# Altium project RTH1.0_GMU.PrjPcb
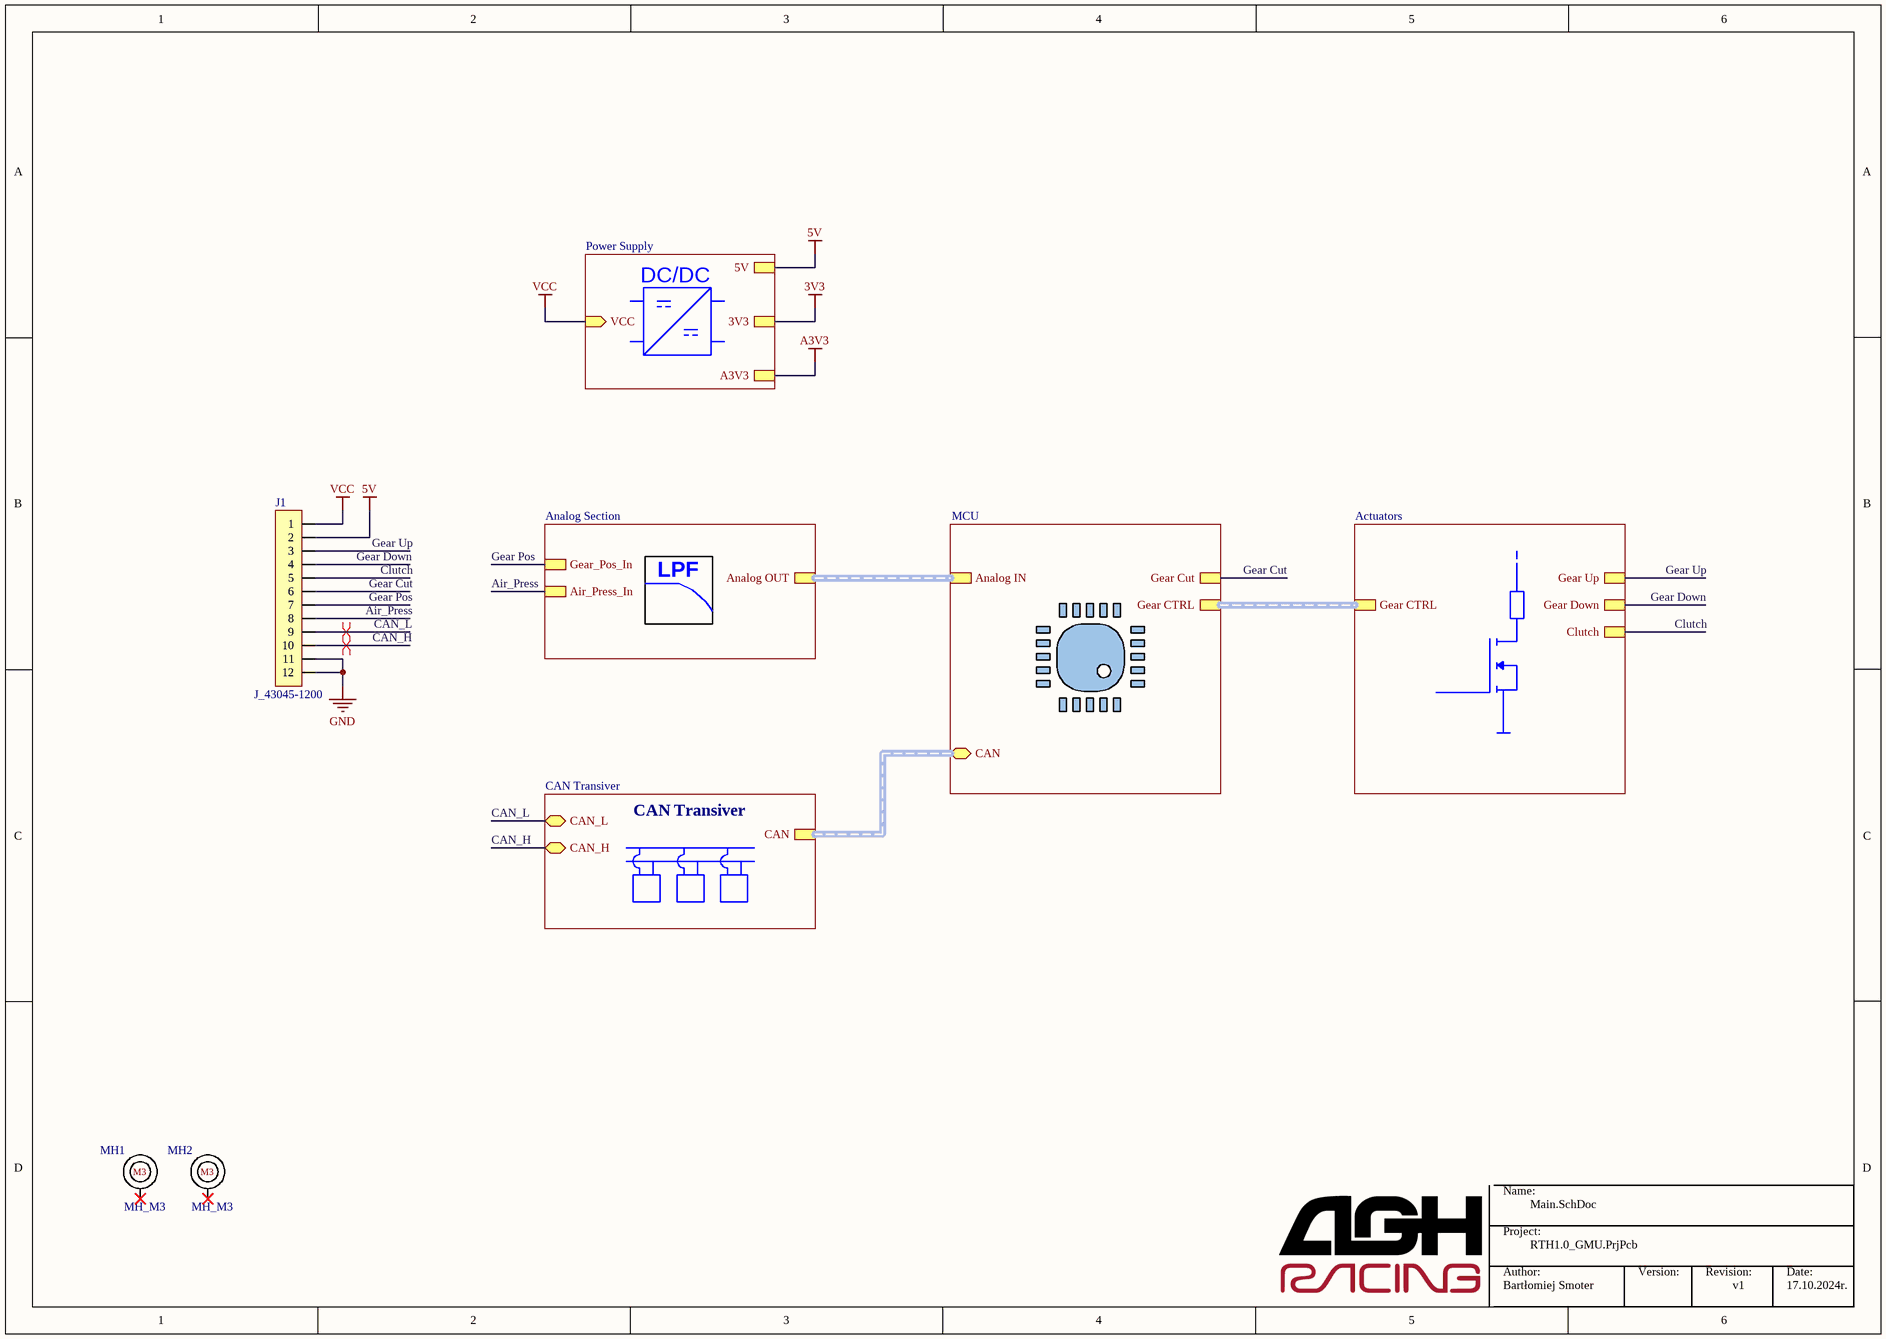
[diagram p0: Main.SchDoc]
6 sheets, 106 parts. Net scope: hierarchical (ports join the sheet entries above them; power ports are global).
Board file: GMU.PcbDoc
Sheets:
  Main.SchDoc
    Power Supply = PowerSupply.SchDoc
    MCU = MCU.SchDoc
    CAN Transiver = CANTransiver.SchDoc
    Analog Section = Analog_Section.SchDoc
    Actuators = Actuators.SchDoc

## Sheet Main.SchDoc: GMU HY
size 353 x 250 mm; Date: 17.10.2024r.; Author: Bartłomiej Smoter; CompanyName: AGH Racing; Revision: v1; SheetNumber: 1; SheetTotal: 6

### Parts
J1  J_43045-1200  [43045-1200]
MH1  MH_M3  [M3]  (no BOM)
MH2  MH_M3  [M3]  (no BOM)

### Sub-sheets
Actuators = Actuators: Gear Up, Gear Down, Clutch, Gear CTRL
Analog Section = Analog_Section: Gear_Pos_In, Air_Press_In, Analog OUT
CAN Transiver = CANTransiver: CAN_H (bidir), CAN_L (bidir), CAN
MCU = MCU: CAN (bidir), Gear CTRL, Gear Cut, Analog IN
Power Supply = PowerSupply: VCC (in), 3V3, 5V, A3V3

### Nets
5V: J1.4(2) ; sheet Power Supply/5V
GND: J1.1(12) J1.11
VCC: J1.7(1) ; sheet Power Supply/VCC  [project net 12V_IN]
Air_Press: J1.12(8) ; sheet Analog Section/Air_Press_In
CAN_H: J1.2(10) ; sheet CAN Transiver/CAN_H
CAN_L: J1.8(9) ; sheet CAN Transiver/CAN_L
Clutch: J1.10(5) ; sheet Actuators/Clutch
Gear Cut: J1.5(6) ; sheet MCU/Gear Cut
Gear Down: J1.3(4) ; sheet Actuators/Gear Down
Gear Pos: J1.6(7) ; sheet Analog Section/Gear_Pos_In
Gear Up: J1.9(3) ; sheet Actuators/Gear Up

Not connected (* = marked no-connect by the designer): MH1 1*; MH2 1*

### Buses and harness runs
harness sheet Actuators/Gear CTRL = sheet MCU/Gear CTRL
harness sheet Analog Section/Analog OUT = sheet MCU/Analog IN
harness sheet CAN Transiver/CAN = sheet MCU/CAN

### Layout directives
differential pair: CAN_H, CAN_L

### Notes on the sheet
- DC/DC
- LPF
- CAN
- Transiver
- Name:
- Project:
- Author:
- Version:
- Revision:
- Date:

### Library data of the parts
J1 = CMP-002-00073-5: Male; Micro-Fit 3.0; 12 Pos. 3mm; 8.5A 600V; Right Angle THT; Mating Part Num.: 43025-1200; Revision Num.: 1; Mating Terminal Num.: 43030-0001; Pin Amount: 12; Mounting Style: Right-Angle; Man. Part Num.: 43045-1200; Series: Micro-Fit 3.0; Max Current Rating: 8.5A; Gender: Male; Pitch: 3mm; HelpURL: https://www.molex.com/en-us/products/part-detail/0430451200?display=pdf; Voltage Rating: 600V; Mounting Technology: THT
MH1 MH2 = CMP-00028-00002-1: Mounting hole; M3 Screw; 3.4mm x 4.3mm; Revision Num.: 1; Man. Part Num.: M3; Diameter: 4.3mm; Hole size: 3.4mm

## Sheet PowerSupply.SchDoc
size 353 x 250 mm; Date: 17.10.2024r.; Author: Bartlomiej Smoter; CompanyName: AGH Racing; Revision: v1; SheetNumber: 2; SheetTotal: 6
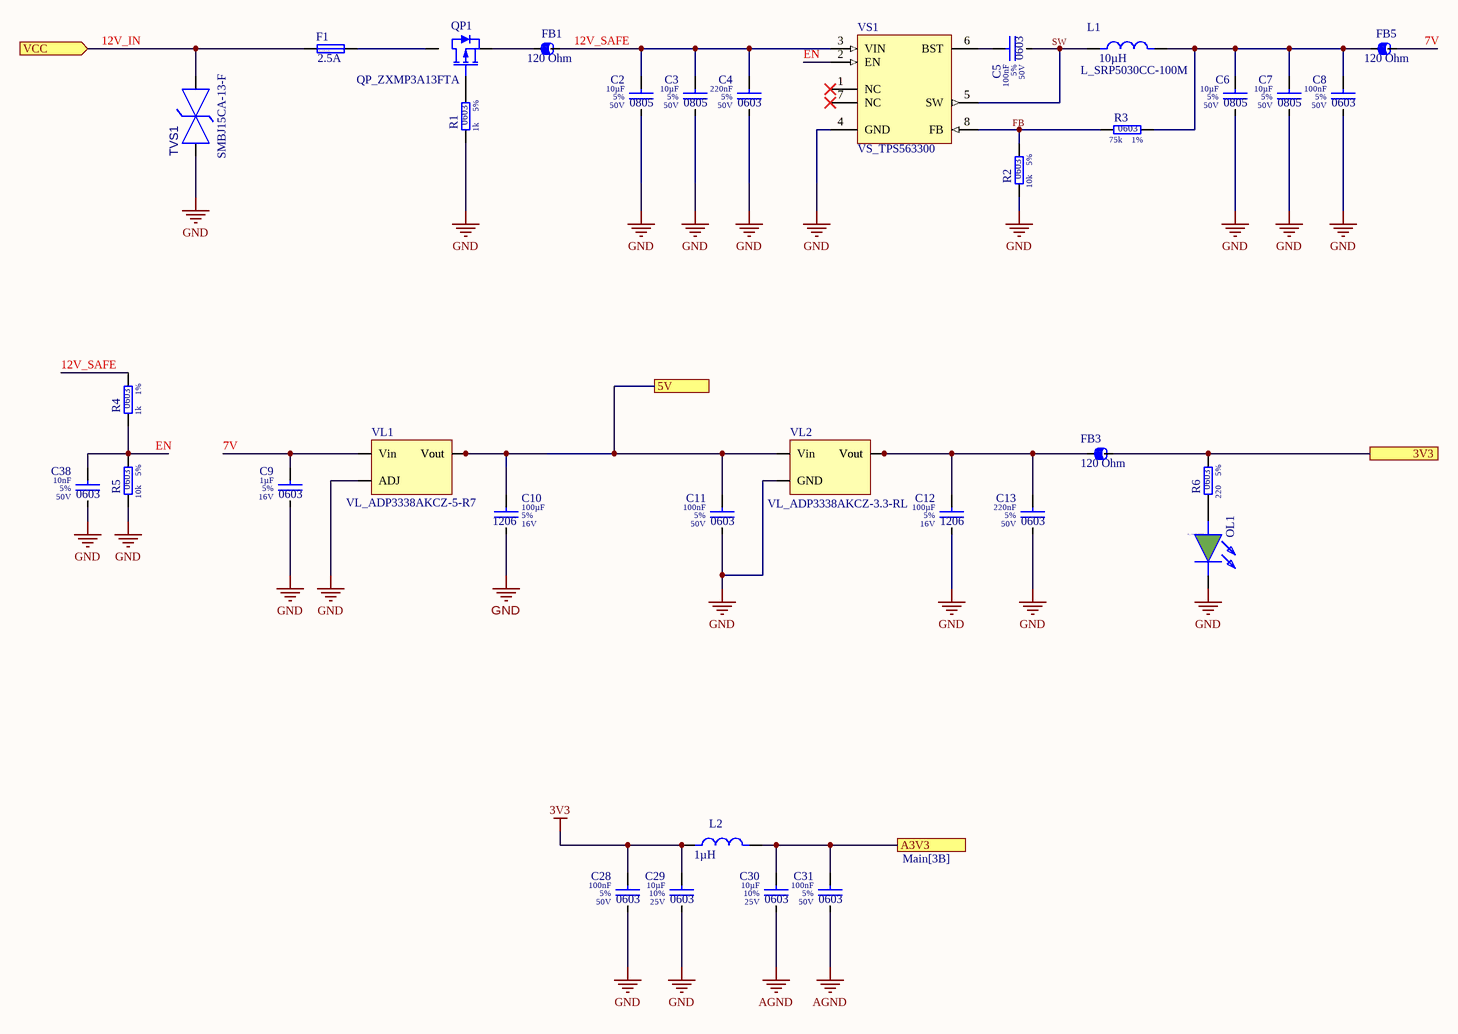
[diagram p1: PowerSupply.SchDoc]

### Parts
C2  value 10µF  Tolerance: 5%  Voltage Rating: 50V  Case/Package: 0805  [0805_Capacitor]  (hidden comment: C_10u_50V_0805_10)
C3  value 10µF  Tolerance: 5%  Voltage Rating: 50V  Case/Package: 0805  [0805_Capacitor]  (hidden comment: C_10u_50V_0805_10)
C4  value 220nF  Tolerance: 5%  Voltage Rating: 50V  Case/Package: 0603  [0603_HandSold_Capacitor]  (hidden comment: C_220n_50V_0603_5)
C5  value 100nF  Tolerance: 5%  Voltage Rating: 50V  Case/Package: 0603  [0603_HandSold_Capacitor]  (hidden comment: C_100n_50V_0603_5)
C6  value 10µF  Tolerance: 5%  Voltage Rating: 50V  Case/Package: 0805  [0805_Capacitor]  (hidden comment: C_10u_50V_0805_10)
C7  value 10µF  Tolerance: 5%  Voltage Rating: 50V  Case/Package: 0805  [0805_Capacitor]  (hidden comment: C_10u_50V_0805_10)
C8  value 100nF  Tolerance: 5%  Voltage Rating: 50V  Case/Package: 0603  [0603_HandSold_Capacitor]  (hidden comment: C_100n_50V_0603_5)
C9  value 1µF  Tolerance: 5%  Voltage Rating: 16V  Case/Package: 0603  [0603_HandSold_Capacitor]  (hidden comment: C_1u_16V_0603_5)
C10  value 100µF  Tolerance: 5%  Voltage Rating: 16V  Case/Package: 1206  [1206_HandSold_Capacitor]  (hidden comment: C_100u_16V_1206_5)
C11  value 100nF  Tolerance: 5%  Voltage Rating: 50V  Case/Package: 0603  [0603_HandSold_Capacitor]  (hidden comment: C_100n_50V_0603_5)
C12  value 100µF  Tolerance: 5%  Voltage Rating: 16V  Case/Package: 1206  [1206_HandSold_Capacitor]  (hidden comment: C_100u_16V_1206_5)
C13  value 220nF  Tolerance: 5%  Voltage Rating: 50V  Case/Package: 0603  [0603_HandSold_Capacitor]  (hidden comment: C_220n_50V_0603_5)
C28  value 100nF  Tolerance: 5%  Voltage Rating: 50V  Case/Package: 0603  [0603_HandSold_Capacitor]  (hidden comment: C_100n_50V_0603_5)
C29  value 10µF  Tolerance: 10%  Voltage Rating: 25V  Case/Package: 0603  [0603_HandSold_Capacitor]  (hidden comment: C_10u_25V_0603_10)
C30  value 10µF  Tolerance: 10%  Voltage Rating: 25V  Case/Package: 0603  [0603_HandSold_Capacitor]  (hidden comment: C_10u_25V_0603_10)
C31  value 100nF  Tolerance: 5%  Voltage Rating: 50V  Case/Package: 0603  [0603_HandSold_Capacitor]  (hidden comment: C_100n_50V_0603_5)
C38  value 10nF  Tolerance: 5%  Voltage Rating: 50V  Case/Package: 0603  [0603_HandSold_Capacitor]  (hidden comment: C_10n_50V_0603_5)
F1  F_1210_2.5A  Trip Current: 2.5A  [1210]
FB1  Impedance: 120 Ohm  [0805_FB]  (hidden comment: FB_BLM21PG121SN1D)
FB3  Impedance: 120 Ohm  [0805_FB]  (hidden comment: FB_BLM21PG121SN1D)
FB5  Impedance: 120 Ohm  [0805_FB]  (hidden comment: FB_BLM21PG121SN1D)
L1  L_SRP5030CC-100M  value 10µH  [L_2220]
L2  value 1µH  [0805_HandSold_Inductor]  (hidden comment: L_TMS201610ALM-1R0MTAA)
OL1  OL_150060VS75000  [0603_HandSold_LED]
QP1  QP_ZXMP3A13FTA  [SOT23]
R1  Tolerance: 5%  Resistance: 1k  Case/Package: 0603  [0603_HandSold_Resistor]  (hidden comment: R_1k_0603_5)
R2  Tolerance: 5%  Resistance: 10k  Case/Package: 0603  [0603_HandSold_Resistor]  (hidden comment: R_10k_0603_5)
R3  Tolerance: 1%  Resistance: 75k  Case/Package: 0603  [0603_HandSold_Resistor]  (hidden comment: R_75k_0603_1)
R4  Tolerance: 1%  Resistance: 1k  Case/Package: 0603  [0603_HandSold_Resistor]  (hidden comment: R_27k_0603_1)
R5  Tolerance: 5%  Resistance: 10k  Case/Package: 0603  [0603_HandSold_Resistor]  (hidden comment: R_10k_0603_5)
R6  Tolerance: 5%  Resistance: 220  Case/Package: 0603  [0603_HandSold_Resistor]  (hidden comment: R_220_0603_5)
TVS1  Man. Part Num.: SMBJ15CA-13-F  [DO-214AA (SMB J-Bend) footprint]  (hidden comment: TVS_SMBJ15CA-13-F)
VL1  VL_ADP3338AKCZ-5-R7  [SOT223-3]
VL2  VL_ADP3338AKCZ-3.3-RL  [SOT223-3]
VS1  VS_TPS563300  [SOT-5X3-8]

### Ports
3V3 (see Main[3A]), 5V (see Main[3A]), A3V3 (see Main[3B]), VCC (in, see Main[2A])

### Nets
3V3: C28.1 C29.1 FB3.2 L2.1 R6.2 ; port 3V3  [project net VDD]
5V: C10.1 C11.1 VL1.2(Vout) VL1.4(Vout) VL2.3(Vin) ; port 5V
12V_IN: F1.1 TVS1.2 ; port VCC
A3V3: C30.1 C31.1 L2.2 ; port A3V3
AGND: C30.2 C31.2
GND: C2.2 C3.2 C4.2 C6.2 C7.2 C8.2 C9.2 C10.2 C11.2 C12.2 C13.2 C28.2 C29.2 C38.2 OL1.1(K) R1.1 R2.1 R5.1 TVS1.1 VL1.1(ADJ) VL2.1(GND) VS1.4(GND)
7V: C9.1 FB5.2 VL1.3(Vin)
12V_SAFE: C2.1 C3.1 C4.1 FB1.2 R4.2 VS1.3(VIN)
EN: C38.1 R4.1 R5.2 VS1.2(EN)
FB: R2.2 R3.1 VS1.8(FB)
SW: C5.2 L1.1 VS1.5(SW)
NetC5_1: C5.1 VS1.6(BST)
NetC6_1: C6.1 C7.1 C8.1 FB5.1 L1.2 R3.2
NetC12_1: C12.1 C13.1 FB3.1 VL2.2(Vout) VL2.4(Vout)
NetF1_2: F1.2 QP1.3(D)
NetFB1_1: FB1.1 QP1.2(S)
NetOL1_2: OL1.2(A) R6.1
NetQP1_1: QP1.1(G) R1.2

Not connected (* = marked no-connect by the designer): VS1 1(NC)* 7(NC)*

### Notes on the sheet
- Name:
- Author:
- Project:
- Revision:
- Date:

### Library data of the parts
C2 C3 C6 C7 = CMP-001-00003-15: Capacitor Type: Ceramic; Revision Num.: 1; HelpURL: https://www.tme.eu/Document/58bb7db4269ac3ad53d1aa3c0ade9bab/GRM.pdf; Mounting Technology: SMT
C4 C13 = CMP-001-00023-24: Revision Num.: 1; Capacitor Type: Ceramic; HelpURL: https://www.mouser.pl/datasheet/2/40/KGM_X7R-3223212.pdf; Mounting Technology: SMT
C5 C8 C11 = CMP-001-00008-25: Capacitor Type: Ceramic; Revision Num.: 1; Mounting Technology: SMT; HelpURL: https://www.tme.eu/Document/78f46414e6dac38b7cca12338ea208b0/X7RDielectric.pdf
C9 = CMP-001-00014-23: Revision Num.: 1; Capacitor Type: Ceramic; HelpURL: https://eu.mouser.com/datasheet/2/40/KGM_X7R-3223212.pdf; Mounting Technology: SMT
C10 C12 = CMP-001-00056-1: Revision Num.: 0; Capacitor Type: Ceramic; Mounting Technology: SMT; HelpURL: https://www.tme.eu/Document/7e71bc7e80441897b2dc5cf4de77e476/c-series_en.pdf
C28 C31 = CMP-001-00008-26: Capacitor Type: Ceramic; Revision Num.: 1; HelpURL: https://www.tme.eu/Document/78f46414e6dac38b7cca12338ea208b0/X7RDielectric.pdf; Mounting Technology: SMT
C29 C30 = CMP-001-00061-2: C_10u_10V_0603_10; Capacitor Type: Ceramic; Revision Num.: 1; Mounting Technology: SMT; HelpURL: https://www.tme.eu/Document/58bb7db4269ac3ad53d1aa3c0ade9bab/GRM.pdf
C38 = CMP-001-00009-25: Capacitor Type: Ceramic; Revision Num.: 1; Mounting Technology: SMT; HelpURL: https://www.tme.eu/Document/78f46414e6dac38b7cca12338ea208b0/X7RDielectric.pdf
F1 = CMP-005-00012-5: Fuse; Resettable; MF-USHT; 0.5A, 2.5A, 20A; 30V, smt; Man. Part Num.: MF-USHT050KX-2; Revision Num.: 1.1; Hold Current: 500mA; Current Rating: 20A; Mounting Technology: SMT; Series: MF-USHT; Case/Package: 1210; Maximum Voltage: 30V; HelpURL: https://www.mouser.pl/datasheet/2/54/mf_usht-1128467.pdf
FB1 = CMP-006-00000-8: Ferrite Beads 120 OHM 25% Alternate Sizing Guide Below; ESR: 30m; Current Rating: 3A; Revision Num.: Revision #1; Mounting Technology: SMT; Man. Part Num.: BLM21PG121SN1D; Case/Package: 0805; HelpURL: https://www.mouser.pl/datasheet/2/281/ENFA0005-1915781.pdf
FB3 FB5 = CMP-006-00000-9: Ferrite Beads 120 OHM 25% Alternate Sizing Guide Below; Revision Num.: Revision #1; ESR: 30m; Current Rating: 3A; Case/Package: 0805; HelpURL: https://www.mouser.pl/datasheet/2/281/ENFA0005-1915781.pdf; Mounting Technology: SMT; Man. Part Num.: BLM21PG121SN1D
L1 = CMP-031-00003-1: SMD Ind,5.7x5.2x2.8mm,10uH+/-20%,2.8A,shd; ESR: 0.102; HelpURL: https://www.mouser.pl/datasheet/2/54/Bourns_07202023_SRP5030CC-3247830.pdf; Current Rating: 2.8A; Man. Part Num.: SRP5030CC-100M; Mounting Technology: SMT; Case/Package: 2220
L2 = CMP-006-00019-2: Inductor; 1uH, 3.1A, 60mΩ, 20%, SMT; ESR: 60m; Revision Num.: 0; HelpURL: https://product.tdk.com/system/files/dam/doc/product/inductor/inductor/smd/catalog/inductor_commercial_power_tms201610alm_en.pdf; Case/Package: 0805; Mounting Technology: SMT; Current Rating: 3.1A; Tolerance: 20%; Man. Part Num.: TMS201610ALM-1R0MTAA
OL1 = CMP-007-00000-15: LED, 0603 Green 2V 30mA  72mW; Revision Num.: 1; Forward Voltage: 2V; Case/Package: 0603; Man. Part Num.: 150060VS75000; Mounting Technology: SMT; Colour: Green; Forward Current: 30mA; Power: 72mW; HelpURL: https://www.mouser.pl/datasheet/2/445/150060VS75000-3085276.pdf
QP1 = CMP-013-00002-22: MOSFET 30V P-Chnl UMOS; Vds / Vce: -30V; Transistor Type: PMOSFET; Vgs / Vbe: -1V; Id / Ic: -1.4A; Power: 625mW; Rds / Rce: 0.33; Revision Num.: Revision #1; Case/Package: SOT23; Mounting Technology: SMT; HelpURL: https://www.diodes.com/assets/Datasheets/ZXMP3A13F.pdf; Man. Part Num.: ZXMP3A13FTA
R1 = CMP-009-00001-19: Revision Num.: 1; Voltage Rating: 75V; Power: 100mW; HelpURL: https://eu.mouser.com/datasheet/2/447/YAGEO_PYu_RC_Group_51_RoHS_L_12-3313492.pdf; Mounting Technology: SMT
R2 R5 = CMP-009-00002-20: Power: 100mW; Voltage Rating: 50V; Revision Num.: 1; HelpURL: https://www.tme.eu/Document/d2a72e545e5c8eb7bf2a04fa97535928/rc0603yageo.pdf; Mounting Technology: SMT
R3 = CMP-009-00121-1: Voltage Rating: 75V; Power: 100mW; Mounting Technology: SMT; HelpURL: https://eu.mouser.com/datasheet/2/315/AOA0000C304-1149620.pdf
R4 = CMP-009-00162-1: Voltage Rating: 75V; Power: 100mW; Revision Num.: 1; Mounting Technology: SMT; HelpURL: https://www.tme.eu/Document/622e28308c06d160637f2b14751ba16b/Data%20Sheet%20CRCW_BCe3.pdf
R6 = CMP-009-00033-15: Power: 100mW; Revision Num.: 1; Voltage Rating: 50V; Mounting Technology: SMT; HelpURL: https://www.mouser.pl/datasheet/2/315/AOA0000C334-1314047.pdf
TVS1 = CMP-00063-1: Diode; TVS; Bidirectional; 15V, 16.7V, 24.4V SMT; HelpURL: https://www.mouser.pl/datasheet/2/115/DIOD_S_A0003133144_1-2542279.pdf; Working Voltage: 15V; Breakdown Voltage: 16.7V; Case/Package: DO-214AA; Polarity: Bidirectional; Clamping Voltage: 24.4V; Mounting Technology: SMT
VL1 = CMP-019-00038-1: LDO; ADP3338AKCZ-5-R7; 1A; 5V; High accuracy over line and load: ±0.8% @ 25°C,; Revision Num.: 1; Power: 5W; Min Supply Voltage: -300mV; Max Supply Voltage: 8.5V; Case/Package: SOT223-3; Max Output Voltage: 5V; Mounting Technology: SMT; Min Output Voltage: 5V; HelpURL: https://www.mouser.pl/datasheet/2/609/ADP3338-1503401.pdf; Man. Part Num.: ADP3338AKCZ-5-R7; Series: ADP3338; Output Current: 1A
VL2 = CMP-019-00039-1: LDO; ADP3338AKCZ-5-R7; 1A; 3.3V; High accuracy over line and load: ±0.8% @ 25°C,; Min Supply Voltage: -300mV; Revision Num.: 1; Power: 5W; Max Supply Voltage: 8.5V; Series: ADP3338; Output Current: 1A; Case/Package: SOT223-3; Man. Part Num.: ADP3338AKCZ-3.3-RL; HelpURL: https://www.mouser.pl/datasheet/2/609/ADP3338-1503401.pdf; Min Output Voltage: 3.3V; Max Output Voltage: 3.3V; Mounting Technology: SMT
VS1 = CMP-019-00023-2: DC/DC Buck; 3.8-V to 28-V, 3-A Synchronous Buck Converter in SOT583 Package; Man. Part Num.: TPS563300DRLR; Revision Num.: 0; Max Supply Voltage: 28V; Max Output Voltage: 22V; Output Current: 3A; Min Output Voltage: 800mV; Min Supply Voltage: 3.8V; HelpURL: https://www.ti.com/lit/ds/symlink/tps563300.pdf?ts=1715787860656&ref_url=https%253A%252F%252Fwww.mouser.co.uk%252F; Mounting Technology: SMT; Case/Package: SOT582

## Sheet MCU.SchDoc
size 353 x 250 mm; Date: 17.10.2024r.; Author: Bartłomiej Smoter; CompanyName: AGH Racing; Revision: v1; SheetNumber: 4; SheetTotal: 6
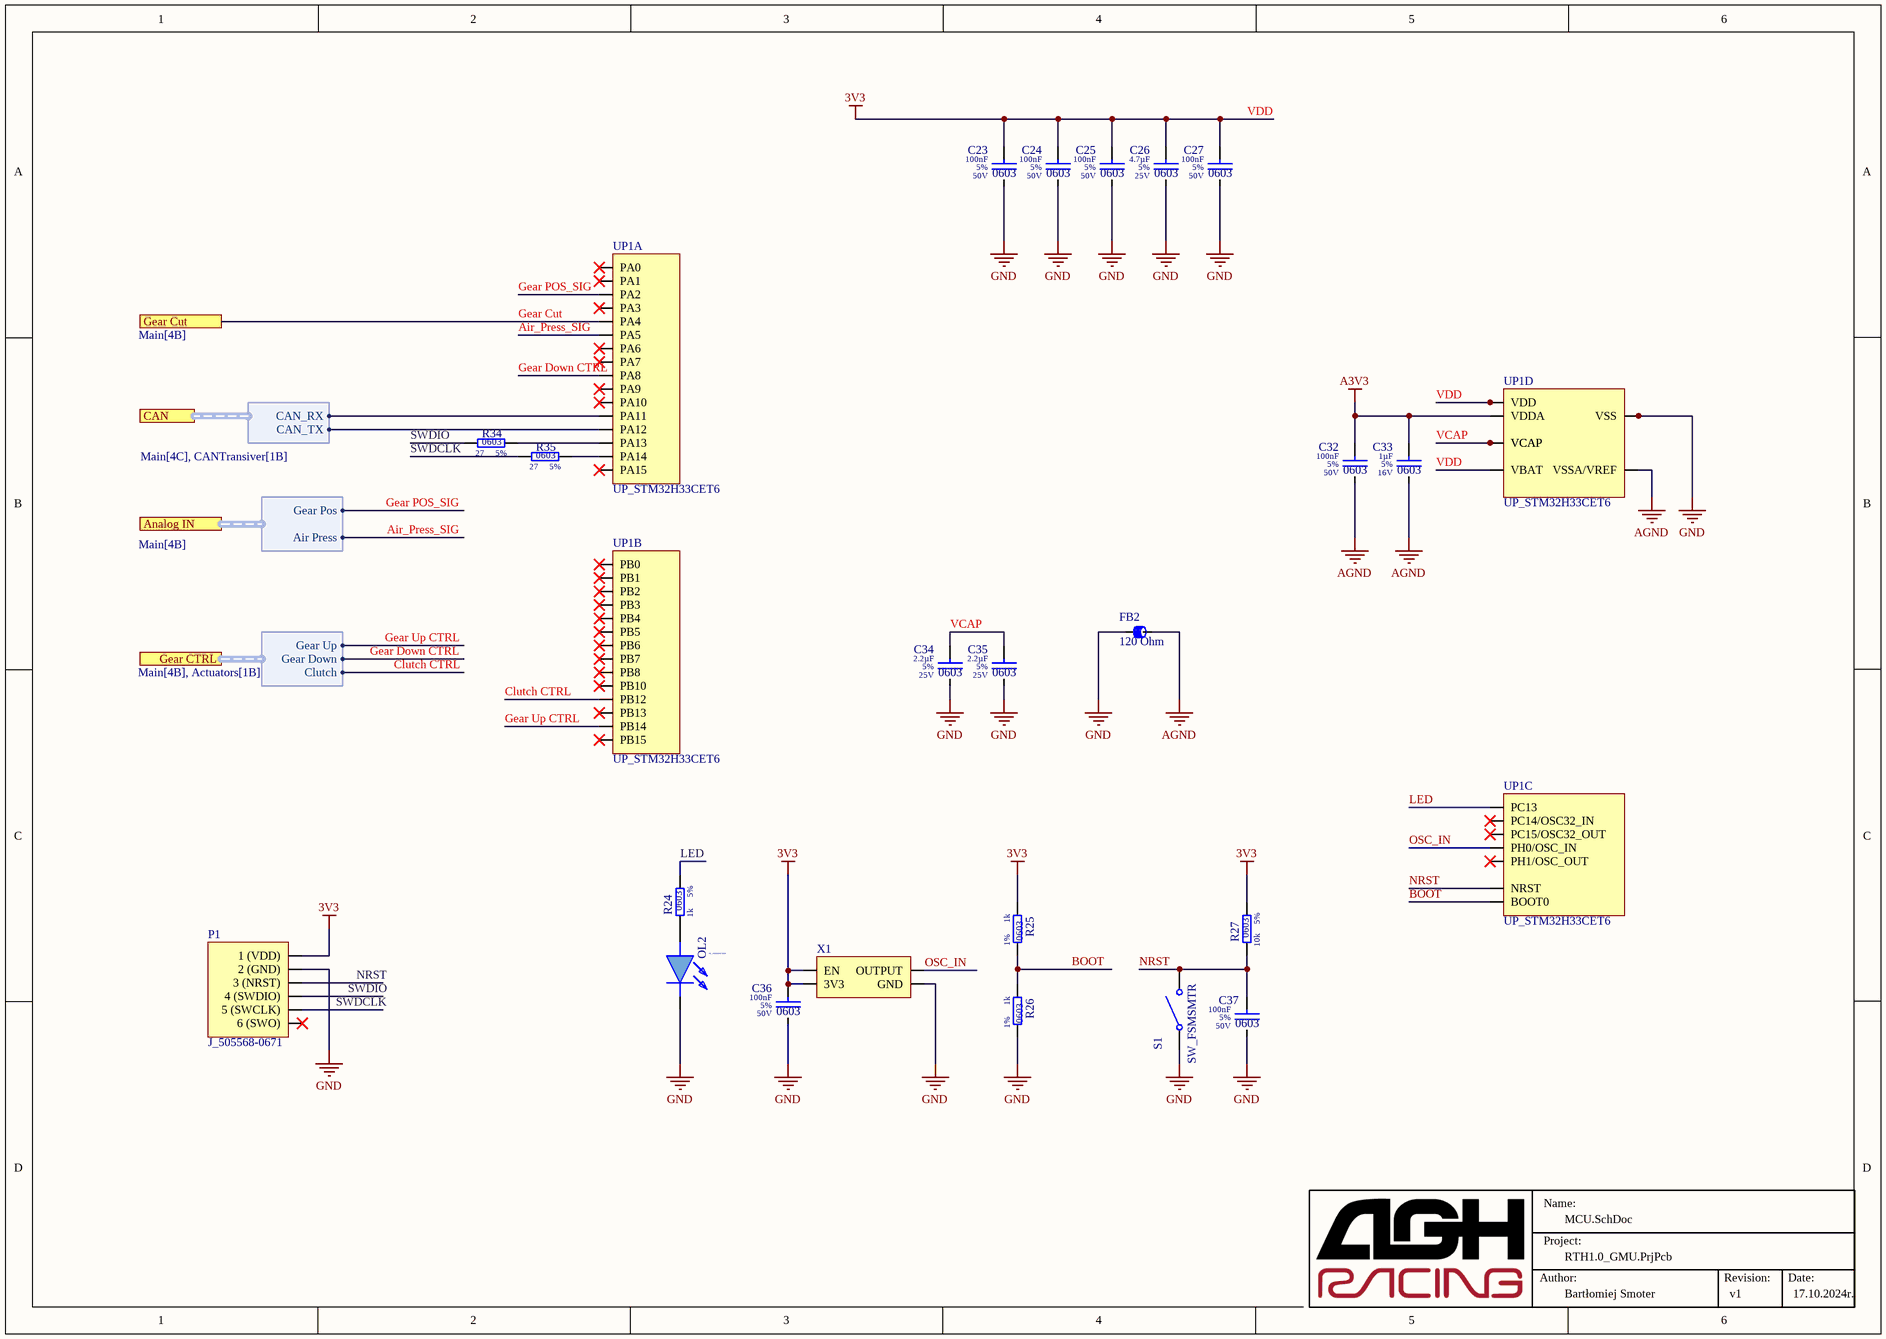
[diagram p2: MCU.SchDoc]

### Parts
C23  value 100nF  Tolerance: 5%  Voltage Rating: 50V  Case/Package: 0603  [0603_HandSold_Capacitor]  (hidden comment: C_100n_50V_0603_5)
C24  value 100nF  Tolerance: 5%  Voltage Rating: 50V  Case/Package: 0603  [0603_HandSold_Capacitor]  (hidden comment: C_100n_50V_0603_5)
C25  value 100nF  Tolerance: 5%  Voltage Rating: 50V  Case/Package: 0603  [0603_HandSold_Capacitor]  (hidden comment: C_100n_50V_0603_5)
C26  value 4.7µF  Tolerance: 5%  Voltage Rating: 25V  Case/Package: 0603  [0603_HandSold_Capacitor]  (hidden comment: C_4.7u_25V_0603_5)
C27  value 100nF  Tolerance: 5%  Voltage Rating: 50V  Case/Package: 0603  [0603_HandSold_Capacitor]  (hidden comment: C_100n_50V_0603_5)
C32  value 100nF  Tolerance: 5%  Voltage Rating: 50V  Case/Package: 0603  [0603_HandSold_Capacitor]  (hidden comment: C_100n_50V_0603_5)
C33  value 1µF  Tolerance: 5%  Voltage Rating: 16V  Case/Package: 0603  [0603_HandSold_Capacitor]  (hidden comment: C_1u_16V_0603_5)
C34  value 2.2µF  Tolerance: 5%  Voltage Rating: 25V  Case/Package: 0603  [0603_HandSold_Capacitor]  (hidden comment: C_2.2u_25V_0603_5)
C35  value 2.2µF  Tolerance: 5%  Voltage Rating: 25V  Case/Package: 0603  [0603_HandSold_Capacitor]  (hidden comment: C_2.2u_25V_0603_5)
C36  value 100nF  Tolerance: 5%  Voltage Rating: 50V  Case/Package: 0603  [0603_HandSold_Capacitor]  (hidden comment: C_100n_50V_0603_5)
C37  value 100nF  Tolerance: 5%  Voltage Rating: 50V  Case/Package: 0603  [0603_HandSold_Capacitor]  (hidden comment: C_100n_50V_0603_5)
FB2  Impedance: 120 Ohm  [0805_FB]  (hidden comment: FB_BLM21PG121SN1D)
OL2  OL_150060BS75000  [0603_HandSold_LED]
P1  J_505568-0671  [505568-0671]
R24  Tolerance: 5%  Resistance: 1k  Case/Package: 0603  [0603_HandSold_Resistor]  (hidden comment: R_1k_0603_5)
R25  Tolerance: 1%  Resistance: 1k  Case/Package: 0603  [0603_HandSold_Resistor]  (hidden comment: R_1k_0603_1)
R26  Tolerance: 1%  Resistance: 1k  Case/Package: 0603  [0603_HandSold_Resistor]  (hidden comment: R_1k_0603_1)
R27  Tolerance: 5%  Resistance: 10k  Case/Package: 0603  [0603_HandSold_Resistor]  (hidden comment: R_10k_0603_5)
R34  Tolerance: 5%  Resistance: 27  Case/Package: 0603  [0603_HandSold_Resistor]  (hidden comment: R_27_0603_5)
R35  Tolerance: 5%  Resistance: 27  Case/Package: 0603  [0603_HandSold_Resistor]  (hidden comment: R_27_0603_5)
S1  SW_FSMSMTR  [TECO-FSMSMTR_V]
UP1  UP_STM32H33CET6  [LQFP48]  (parts A,B,C,D of 4)
X1  X_16MHz_LFSPXO066657CUTT  [X_2mm_2.5mm_oscillator]  (value not drawn)

### Ports
Analog IN (harness ANAL, see Main[4B]), CAN (harness CAN, see Main[4C], CANTransiver[1B]), Gear CTRL (harness Gears, see Main[4B], Actuators[1B]), Gear Cut (see Main[4B])

### Harnesses
CAN: CAN_RX, CAN_TX
Gears: Gear Up, Gear Down, Clutch
ANAL: Gear Pos, Air Press

### Nets
A3V3: C32.1 C33.1 UP1.9(VDDA)
AGND: C32.2 C33.2 FB2.2 UP1.8(VSSA/VREF)
GND: C23.2 C24.2 C25.2 C26.2 C27.2 C34.2 C35.2 C36.2 C37.2 FB2.1 OL2.1(K) P1.2(2_(GND)) R26.2 S1.1 UP1.23(VSS) UP1.35(VSS) UP1.47(VSS) X1.2(GND)
VDD: C23.1 C24.1 C25.1 C26.1 C27.1 C36.1 P1.1(1_(VDD)) R25.1 R27.2 UP1.1(VBAT) UP1.24(VDD) UP1.36(VDD) UP1.48(VDD) X1.1(EN) X1.4(3V3)  [also labelled 3V3]
Air_Press_SIG: UP1.15(PA5) ; port Analog IN.Air Press  [project net Air_Press_RC_LPF]
BOOT: R25.2 R26.1 UP1.44(BOOT0)
CAN_RX: UP1.32(PA11) ; port CAN.CAN_RX
CAN_TX: UP1.33(PA12) ; port CAN.CAN_TX
Clutch CTRL: UP1.25(PB12) ; port Gear CTRL.Clutch
Gear Cut: UP1.14(PA4) ; port Gear Cut
Gear Down CTRL: UP1.29(PA8) ; port Gear CTRL.Gear Down
Gear POS_SIG: UP1.12(PA2) ; port Analog IN.Gear Pos
Gear Up CTRL: UP1.27(PB14) ; port Gear CTRL.Gear Up
LED: R24.2 UP1.2(PC13)
NRST: C37.1 P1.3(3_(NRST)) R27.1 S1.2 UP1.7(NRST)
OSC_IN: UP1.5(PH0/OSC_IN) X1.3(OUTPUT)
SWDCLK: P1.5(5_(SWCLK)) R35.1
SWDIO: P1.4(4_(SWDIO)) R34.1
VCAP: C34.1 C35.1 UP1.22(VCAP) UP1.46(VCAP)
NetOL2_2: OL2.2(A) R24.1
NetR34_2: R34.2 UP1.34(PA13)
NetR35_2: R35.2 UP1.37(PA14)

Not connected (* = marked no-connect by the designer): P1 6(6_(SWO))*; UP1 3(PC14/OSC32_IN)* 4(PC15/OSC32_OUT)* 6(PH1/OSC_OUT)* 10(PA0)* 11(PA1)* 13(PA3)* 16(PA6)* 17(PA7)* 18(PB0)* 19(PB1)* 20(PB2)* 21(PB10)* 26(PB13)* 28(PB15)* 30(PA9)* 31(PA10)* 38(PA15)* 39(PB3)* 40(PB4)* 41(PB5)* 42(PB6)* 43(PB7)* 45(PB8)*

### Notes on the sheet
- Name:
- Author:
- Project:
- Revision:
- Date:

### Library data of the parts
C23-C25 C27 C32 = CMP-001-00008-26: as C28 on sheet PowerSupply; HelpURL: https://www.tme.eu/Document/78f46414e6dac38b7cca12338ea208b0/X7RDielectric.pdf; Mounting Technology: SMT
C26 = CMP-001-00011-25: Revision Num.: 1; Capacitor Type: Ceramic; Mounting Technology: SMT; HelpURL: https://eu.mouser.com/datasheet/2/40/cx5r_KGM-3223198.pdf
C33 = CMP-001-00014-23: as C9 on sheet PowerSupply; HelpURL: https://eu.mouser.com/datasheet/2/40/KGM_X7R-3223212.pdf; Mounting Technology: SMT
C34 C35 = CMP-001-00022-23: Capacitor Type: Ceramic; Revision Num.: 1; HelpURL: https://eu.mouser.com/datasheet/2/281/1/GRT188C71E225KE13_01A-3158366.pdf; Mounting Technology: SMT
C36 C37 = CMP-001-00008-22: Revision Num.: 1; Capacitor Type: Ceramic; Mounting Technology: SMT; HelpURL: https://www.tme.eu/Document/78f46414e6dac38b7cca12338ea208b0/X7RDielectric.pdf
FB2 = CMP-006-00000-9: as FB3 on sheet PowerSupply; Case/Package: 0805; HelpURL: https://www.mouser.pl/datasheet/2/281/ENFA0005-1915781.pdf; Mounting Technology: SMT; Man. Part Num.: BLM21PG121SN1D
OL2 = CMP-007-00001-11: LED 0603, Blue, 3.2V, 30mA, 105mW; Revision Num.: 1; HelpURL: https://www.we-online.com/components/products/datasheet/150060BS75000.pdf; Power: 105mW; Forward Voltage: 3.2V; Colour: Blue; Case/Package: 0603; Forward Current: 30mA; Mounting Technology: SMT; Man. Part Num.: 150060BS75000
P1 = CMP-002-00003-12: Male; Micro-Lock Plus; 6 Pos. 1.25mm; 1.5A 50V; Straight; SMT;; Mating Part Num.: 45111-0600; Pin Amount: 6; Revision Num.: 1; Mounting Style: Straight; Max Current Rating: 1.5A; Mounting Technology: SMT; Voltage Rating: 50V; Man. Part Num.: 505568-0671; Gender: Male; HelpURL: https://www.molex.com/en-us/products/part-detail/5055680671?display=pdf; Pitch: 1.25mm; Series: Micro-Lock Plus
R24 = CMP-009-00001-19: as R1 on sheet PowerSupply; HelpURL: https://eu.mouser.com/datasheet/2/447/YAGEO_PYu_RC_Group_51_RoHS_L_12-3313492.pdf; Mounting Technology: SMT
R25 R26 = CMP-009-00099-4: Revision Num.: 1; Voltage Rating: 75V; Power: 100mW; HelpURL: https://www.tme.eu/Document/622e28308c06d160637f2b14751ba16b/Data%20Sheet%20CRCW_BCe3.pdf; Mounting Technology: SMT
R27 = CMP-009-00002-16: Voltage Rating: 50V; Revision Num.: 1; Power: 100mW; HelpURL: https://www.tme.eu/Document/d2a72e545e5c8eb7bf2a04fa97535928/rc0603yageo.pdf; Mounting Technology: SMT
R34 R35 = CMP-009-00038-16: Voltage Rating: 50V; Revision Num.: 1; Power: 100mW; HelpURL: https://www.mouser.pl/datasheet/2/54/cr-1858361.pdf; Mounting Technology: SMT
S1 = CMP-011-00002-8: Switch; Tact; OFF-(ON); 50mA; 24V; Revision Num.: 1; Switch Type: Tact; Man. Part Num.: FSMSMTR; Mounting Technology: SMT; HelpURL: https://www.mouser.pl/ProductDetail/TE-Connectivity-Alcoswitch/FSMSMTR?qs=UhRTNahLC3z8whMdncX%252BKw%3D%3D; Configuration: OFF-(ON); Current Rating: 50mA; Voltage Rating: 24V
UP1 = CMP-020-00018-2: MCU High-performance Arm Cortex-M33 MCU 512-Kbyte Flash 272-Kbyte RAM 250 MHz CPU; Clock Frequency: 250MHz; ROM Size: 512kB; Revision Num.: 1; Max Supply Voltage: 3.6V; Min Supply Voltage: 1.7V; RAM Size: 272kB; Series: STM32H533xx; HelpURL: https://www.google.com/url?sa=t&source=web&rct=j&opi=89978449&url=https://www.st.com/resource/en/datasheet/stm32h753vi.pdf&ved=2ahUKEwiFsajI8PeHAxUmDRAIHcL-A8EQFnoECBQQAQ&usg=AOvVaw1bta1P1SH6GWAhwR0-a_c9; Case/Package: LQFP48; Pins: 37; Mounting Technology: SMT; Man. Part Num.: STM32H33CET6
X1 = X_16MHz_LFSPXO066657CUTT-6: Frequency: 16MHz; HelpURL: https://www.tme.eu/Document/f2507c161887e0dea281275093e92f79/LFSPXO066657CUTT.pdf; Man. Part Num.: LFSPXO066657CUTT; Mounting Technology: SMT

## Sheet CANTransiver.SchDoc
size 250 x 176 mm; Date: 17.10.2024r.; Author: Bartłomiej Smoter; Revision: v1; SheetNumber: 3; SheetTotal: 6
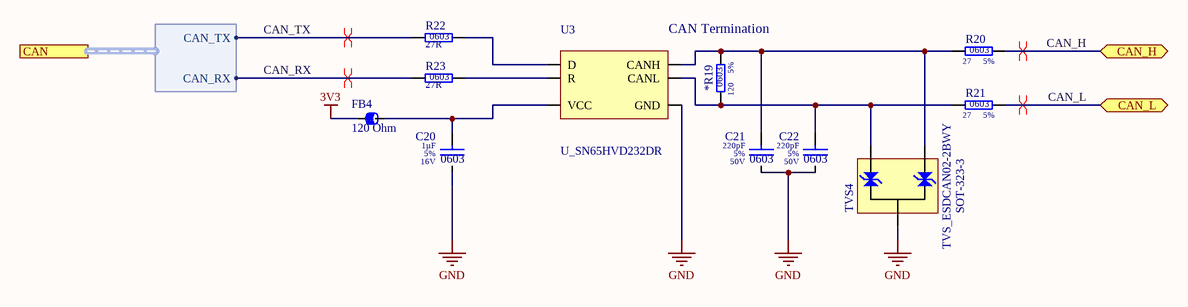
[diagram p3: CANTransiver.SchDoc]

### Parts
*R19  Tolerance: 5%  Resistance: 120  Case/Package: 0603  [0603_HandSold_Resistor]  (hidden comment: R_120_0603_5)
C20  value 1µF  Tolerance: 5%  Voltage Rating: 16V  Case/Package: 0603  [0603_HandSold_Capacitor]  (hidden comment: C_1u_16V_0603_5)
C21  value 220pF  Tolerance: 5%  Voltage Rating: 50V  Case/Package: 0603  [0603_HandSold_Capacitor]  (hidden comment: C_220p_50V_0603_5)
C22  value 220pF  Tolerance: 5%  Voltage Rating: 50V  Case/Package: 0603  [0603_HandSold_Capacitor]  (hidden comment: C_220p_50V_0603_5)
FB4  Impedance: 120 Ohm  [0805_FB]  (hidden comment: FB_BLM21PG121SN1D)
R20  Tolerance: 5%  Resistance: 27  Case/Package: 0603  [0603_HandSold_Resistor]  (hidden comment: R_27_0603_5)
R21  Tolerance: 5%  Resistance: 27  Case/Package: 0603  [0603_HandSold_Resistor]  (hidden comment: R_27_0603_5)
R22  value 27R  SCH_Footprint: 0603  [R_0603_1608]  (hidden comment: Resistor)
R23  value 27R  SCH_Footprint: 0603  [R_0603_1608]  (hidden comment: Resistor)
TVS4  TVS_ESDCAN02-2BWY  [SOT-323-3]
U3  U_SN65HVD232DR  [SOIC8]

### Ports
CAN (harness CAN, see Main[3C], MCU[1B]), CAN_H (bidir, see Main[2C]), CAN_L (bidir, see Main[2C])

### Harnesses
CAN: CAN_TX, CAN_RX

### Nets
3V3: FB4.1  [project net VDD]
GND: C20.2 C21.2 C22.2 TVS4.3 U3.2(GND)
CAN_H: R20.2 ; port CAN_H
CAN_L: R21.2 ; port CAN_L
CAN_RX: R23.1 ; port CAN.CAN_RX
CAN_TX: R22.1 ; port CAN.CAN_TX
Net*R19_1: *R19.1 C22.1 R21.1 TVS4.2 U3.6(CANL)
Net*R19_2: *R19.2 C21.1 R20.1 TVS4.1 U3.7(CANH)
NetC20_1: C20.1 FB4.2 U3.3(VCC)
NetR22_2: R22.2 U3.1(D)
NetR23_2: R23.2 U3.4(R)

### Layout directives
differential pair: CAN_H, CAN_L, CAN_RX, CAN_TX

### Notes on the sheet
- CAN Termination
- Name:
- Author:
- Project:
- Revision:
- Date:

### Library data of the parts
*R19 = CMP-009-00040-15: Power: 100mW; Voltage Rating: 50V; Revision Num.: 1; SCH_Footprint: 0603; Mounting Technology: SMT; HelpURL: https://www.tme.eu/Document/d2a72e545e5c8eb7bf2a04fa97535928/rc0603yageo.pdf
C20 = CMP-001-00014-23: as C9 on sheet PowerSupply; HelpURL: https://eu.mouser.com/datasheet/2/40/KGM_X7R-3223212.pdf; Mounting Technology: SMT
C21 C22 = CMP-001-00019-21: Revision Num.: 1; Capacitor Type: Ceramic; Mounting Technology: SMT; Revision: 1; HelpURL: https://www.tme.eu/Document/bbf9b851c2f67970461c4f5edb477604/C0GNP0-Dielectric.pdf
FB4 = CMP-006-00000-9: as FB3 on sheet PowerSupply; Case/Package: 0805; HelpURL: https://www.mouser.pl/datasheet/2/281/ENFA0005-1915781.pdf; Mounting Technology: SMT; Man. Part Num.: BLM21PG121SN1D
R20 R21 = CMP-009-00038-16: as R34 on sheet MCU; HelpURL: https://www.mouser.pl/datasheet/2/54/cr-1858361.pdf; Mounting Technology: SMT
R22 R23 = R_27R_0603_1: Manufacturer: Vishay; Manufacturer Part Number: CRCW060327R0FKEAHP; Voltage: 75V; Power: 330mW; Tolerance: 1%; Part Number: R_27R_0603_1; HelpURL: https://www.vishay.com/docs/20043/crcwhpe3.pdf; Supplier 1: TME; Supplier 2: RS Components; Supplier 3: Farnell; Supplier Part Number 3: 1738883; Supplier 4: Mouser; Supplier Part Number 4: 71-CRCW060327R0FKEAH; Supplier 5: Digi-Key; Supplier Part Number 5: 541-27.0SCT-ND; Supplier 6: LCSC; Supplier Part Number 6: C313718
TVS4 = CMP-013-00005-12: Diode; 2x TVS; 26.5V 28.5V 44V; Revision Num.: 1; Polarity: Bidirectional; Case/Package: SOT-323-3; Breakdown Voltage: 28.5V; Mounting Technology: SMT; Man. Part Num.: ESDCAN02-2BWY; HelpURL: https://www.mouser.pl/datasheet/2/389/esdcan03_2bwy-1849066.pdf; Working Voltage: 26.5V; Clamping Voltage: 44V
U3 = CMP-013-00004-10: Transceiver; CAN; SN65HVD232; 1Mb/s; 3.3V SMT; Min Supply Voltage: 3V; Max Supply Voltage: 3.6V; Revision Num.: 1; HelpURL: https://www.ti.com/general/docs/suppproductinfo.tsp?distId=26&gotoUrl=https://www.ti.com/lit/gpn/sn65hvd230; Mounting Technology: SMT; Data Rate: 1Mb/s; Man. Part Num.: SN65HVD232DR; Series: SN65HVD232; Case/Package: SOIC8; Communication: CAN

## Sheet Analog_Section.SchDoc
size 353 x 250 mm; Date: 17.10.2024r.; Author: Bartłomiej Smoter; CompanyName: AGH Racing; Revision: v1; SheetNumber: 5; SheetTotal: 6
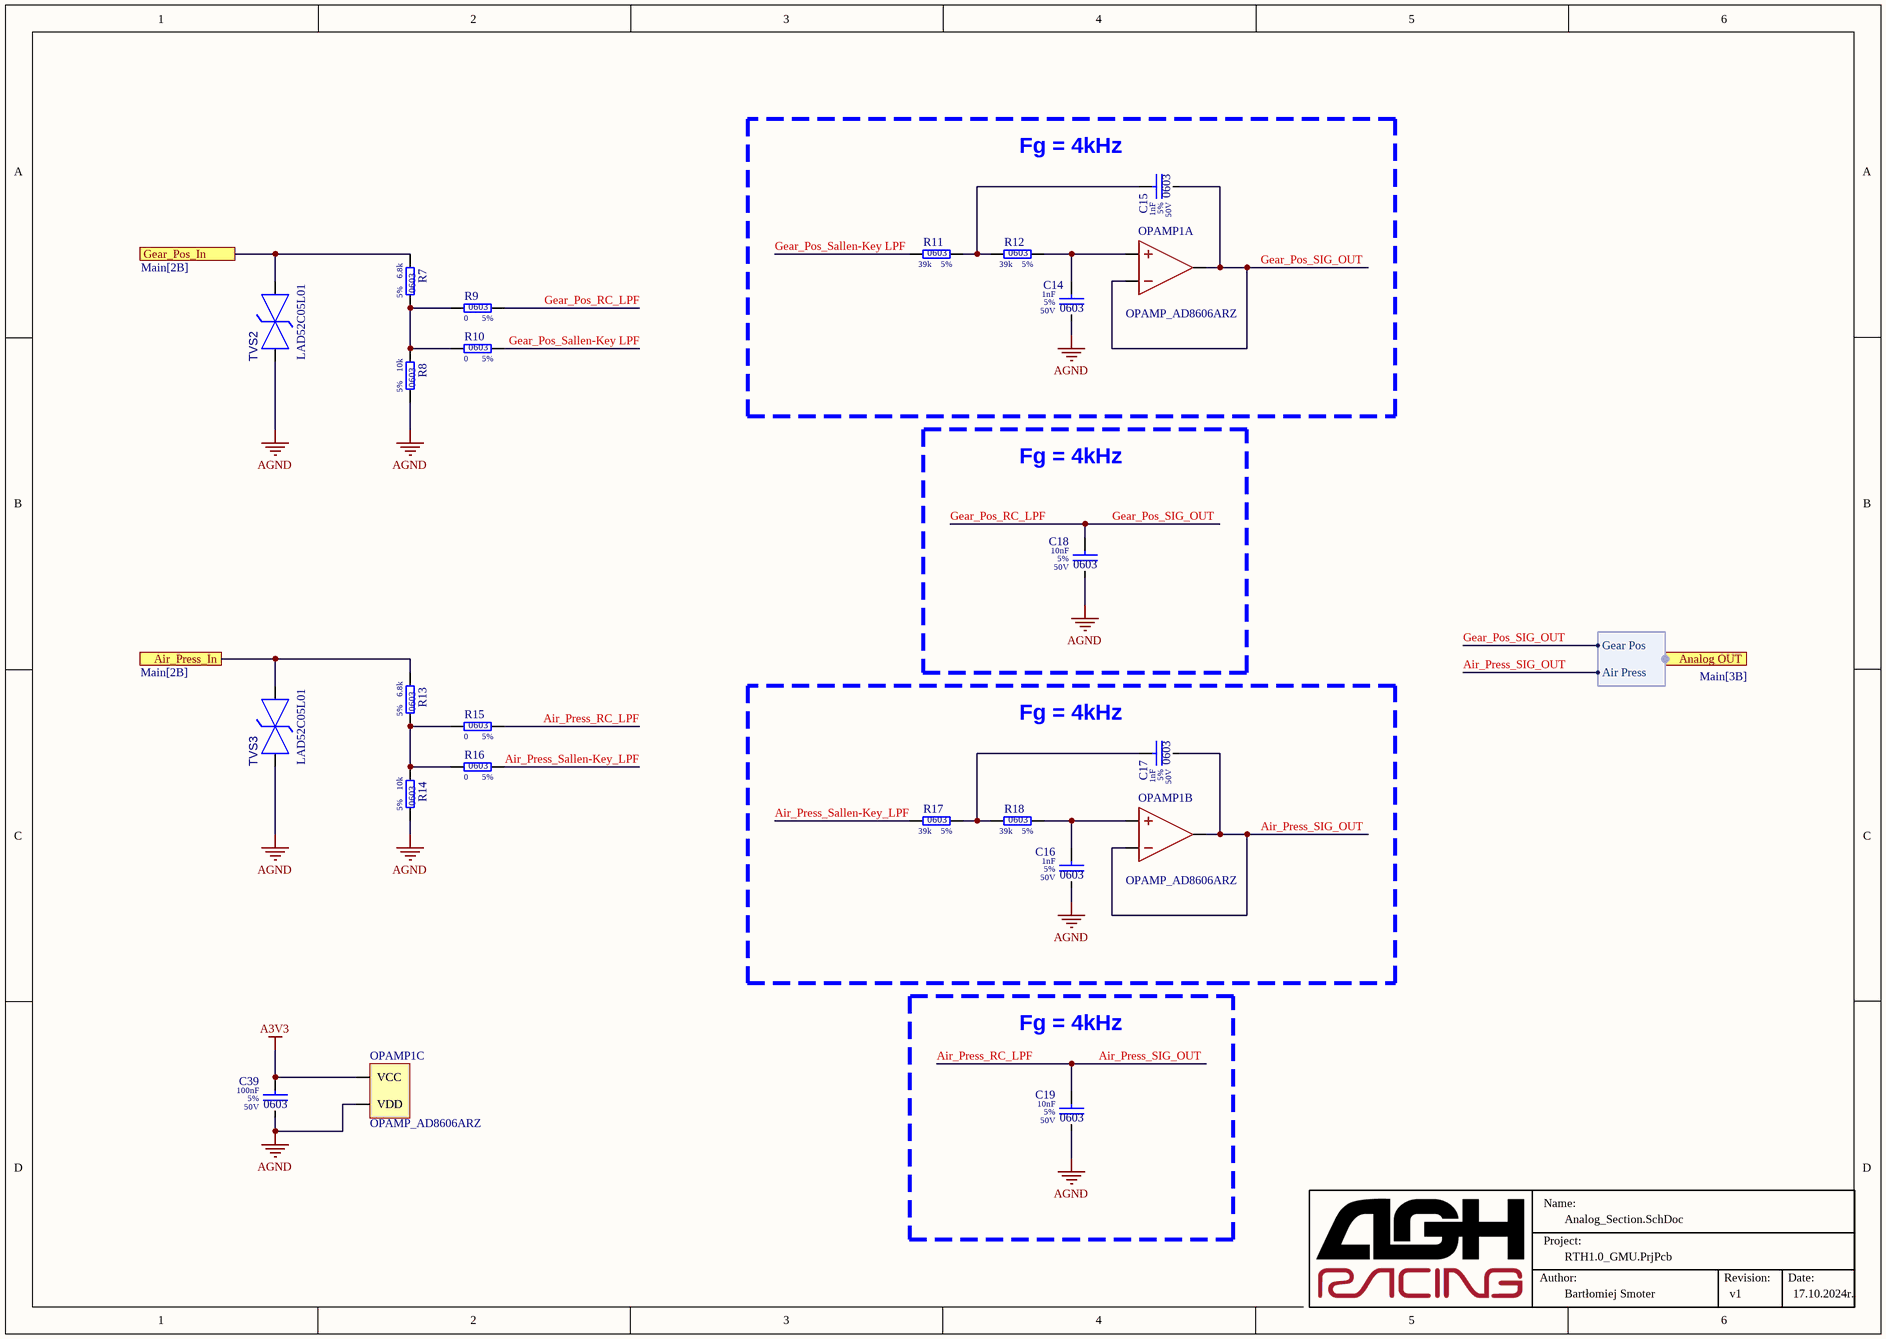
[diagram p4: Analog_Section.SchDoc]

### Parts
C14  value 1nF  Tolerance: 5%  Voltage Rating: 50V  Case/Package: 0603  [0603_HandSold_Capacitor]  (hidden comment: C_1n_50V_0603_5)
C15  value 1nF  Tolerance: 5%  Voltage Rating: 50V  Case/Package: 0603  [0603_HandSold_Capacitor]  (hidden comment: C_1n_50V_0603_5)
C16  value 1nF  Tolerance: 5%  Voltage Rating: 50V  Case/Package: 0603  [0603_HandSold_Capacitor]  (hidden comment: C_1n_50V_0603_5)
C17  value 1nF  Tolerance: 5%  Voltage Rating: 50V  Case/Package: 0603  [0603_HandSold_Capacitor]  (hidden comment: C_1n_50V_0603_5)
C18  value 10nF  Tolerance: 5%  Voltage Rating: 50V  Case/Package: 0603  [0603_HandSold_Capacitor]  (hidden comment: C_10n_50V_0603_5)
C19  value 10nF  Tolerance: 5%  Voltage Rating: 50V  Case/Package: 0603  [0603_HandSold_Capacitor]  (hidden comment: C_10n_50V_0603_5)
C39  value 100nF  Tolerance: 5%  Voltage Rating: 50V  Case/Package: 0603  [0603_HandSold_Capacitor]  (hidden comment: C_100n_50V_0603_5)
OPAMP1  OPAMP_AD8606ARZ  [SOIC-8]  (parts A,B,C of 3)
R7  Tolerance: 5%  Resistance: 6.8k  Case/Package: 0603  [0603_HandSold_Resistor]  (hidden comment: R_6.8k_0603_5)
R8  Tolerance: 5%  Resistance: 10k  Case/Package: 0603  [0603_HandSold_Resistor]  (hidden comment: R_10k_0603_5)
R9  Tolerance: 5%  Resistance: 0  Case/Package: 0603  [0603_HandSold_Resistor]  (hidden comment: R_0_0603_5)
R10  Tolerance: 5%  Resistance: 0  Case/Package: 0603  [0603_HandSold_Resistor]  (hidden comment: R_0_0603_5)
R11  Tolerance: 5%  Resistance: 39k  Case/Package: 0603  [0603_HandSold_Resistor]  (hidden comment: R_39k_0603_5)
R12  Tolerance: 5%  Resistance: 39k  Case/Package: 0603  [0603_HandSold_Resistor]  (hidden comment: R_39k_0603_5)
R13  Tolerance: 5%  Resistance: 6.8k  Case/Package: 0603  [0603_HandSold_Resistor]  (hidden comment: R_6.8k_0603_5)
R14  Tolerance: 5%  Resistance: 10k  Case/Package: 0603  [0603_HandSold_Resistor]  (hidden comment: R_10k_0603_5)
R15  Tolerance: 5%  Resistance: 0  Case/Package: 0603  [0603_HandSold_Resistor]  (hidden comment: R_0_0603_5)
R16  Tolerance: 5%  Resistance: 0  Case/Package: 0603  [0603_HandSold_Resistor]  (hidden comment: R_0_0603_5)
R17  Tolerance: 5%  Resistance: 39k  Case/Package: 0603  [0603_HandSold_Resistor]  (hidden comment: R_39k_0603_5)
R18  Tolerance: 5%  Resistance: 39k  Case/Package: 0603  [0603_HandSold_Resistor]  (hidden comment: R_39k_0603_5)
TVS2  Man. Part Num.: LAD52C05L01  [SOD-523-2_ALT]  (hidden comment: TVS_LAD52C05L01)
TVS3  Man. Part Num.: LAD52C05L01  [SOD-523-2_ALT]  (hidden comment: TVS_LAD52C05L01)

### Blocks framed on the sheet
Fg = 4kHz: C14 C15 OPAMP1 R11 R12
Fg = 4kHz: C18
Fg = 4kHz: C16 C17 OPAMP1 R17 R18
Fg = 4kHz: C19

### Ports
Air_Press_In (see Main[2B]), Analog OUT (harness ANAL, see Main[3B]), Gear_Pos_In (see Main[2B])

### Harnesses
ANAL: Gear Pos, Air Press

### Nets
A3V3: C39.1 OPAMP1.8(VCC)
AGND: C14.2 C16.2 C18.2 C19.2 C39.2 OPAMP1.4(VDD) R8.2 R14.2 TVS2.1 TVS3.1
Air_Press: R13.1 TVS3.2 ; port Air_Press_In
Air_Press_RC_LPF: C17.2 C19.1 OPAMP1.6(2IN-) OPAMP1.7(2OUT) R15.2 ; port Analog OUT.Air Press  [also labelled Air_Press_SIG_OUT]
Air_Press_Sallen-Key_LPF: R16.2 R17.1
Gear Pos: R7.1 TVS2.2 ; port Gear_Pos_In
Gear_Pos_RC_LPF: C15.2 C18.1 OPAMP1.1(1OUT) OPAMP1.2(1IN-) R9.2 ; port Analog OUT.Gear Pos  [also labelled Gear_Pos_SIG_OUT]  [project net Gear POS_SIG]
Gear_Pos_Sallen-Key LPF: R10.2 R11.1
NetC14_1: C14.1 OPAMP1.3(1IN+) R12.2
NetC15_1: C15.1 R11.2 R12.1
NetC16_1: C16.1 OPAMP1.5(2IN+) R18.2
NetC17_1: C17.1 R17.2 R18.1
NetR7_2: R7.2 R8.1 R9.1 R10.1
NetR13_2: R13.2 R14.1 R15.1 R16.1

### Notes on the sheet
- Name:
- Author:
- Project:
- Revision:
- Date:

### Library data of the parts
C14-C17 = CMP-001-00012-23: Capacitor Type: Ceramic; Revision Num.: 1; Mounting Technology: SMT; HelpURL: https://www.tme.eu/Document/c9f83032181d562eecbad103d884e6f2/C0603C102J5RACTU.pdf
C18 C19 = CMP-001-00009-26: Revision Num.: 1; Capacitor Type: Ceramic; Mounting Technology: SMT; HelpURL: https://www.tme.eu/Document/78f46414e6dac38b7cca12338ea208b0/X7RDielectric.pdf
C39 = CMP-001-00008-26: as C28 on sheet PowerSupply; HelpURL: https://www.tme.eu/Document/78f46414e6dac38b7cca12338ea208b0/X7RDielectric.pdf; Mounting Technology: SMT
OPAMP1 = CMP-014-00019-1: Precision Amplifiers DUAL, PRECISION CMOS RAIL-RAIL OP AMP, GBP - 10MHz, SR - 5V/us, Vos - 20mV, Ib - 250pA; Max Supply Voltage: 5V; Channels: 2; Power: 1.25W; Min Supply Voltage: 2.7V; HelpURL: https://www.mouser.pl/datasheet/2/609/AD8605_8606_8608-1716254.pdf; Mounting Technology: SMT; Man. Part Num.: AD8606ARZ; Case/Package: SOIC-8
R7 R13 = CMP-009-00043-18: Power: 100mW; Voltage Rating: 50V; Revision Num.: 1; Mounting Technology: SMT; HelpURL: https://www.mouser.pl/datasheet/2/54/cr-1858361.pdf
R8 R14 = CMP-009-00002-20: as R2 on sheet PowerSupply; HelpURL: https://www.tme.eu/Document/d2a72e545e5c8eb7bf2a04fa97535928/rc0603yageo.pdf; Mounting Technology: SMT
R9 R10 R15 R16 = CMP-009-00016-19: Revision Num.: 1; Power: 100mW; Voltage Rating: 50V; HelpURL: https://www.tme.eu/Document/c283990e907c122bb808207d1578ac7f/POWER_RATING-DTE.pdf; Mounting Technology: SMT
R11 R12 R17 R18 = CMP-009-00157-1: Voltage Rating: 75V; Power: 100mW; Revision Num.: 1; HelpURL: https://www.mouser.pl/datasheet/2/315/AOA0000C301-1488782.pdf; Mounting Technology: SMT
TVS2 TVS3 = CMP-004-00007-6: Diode; TVS; 5V 5.6V 9.8V; Polarity: Bidirectional; Revision Num.: 1; Mounting Technology: SMT; Breakdown Voltage: 5.6V; Case/Package: SOD-523; HelpURL: https://eu.mouser.com/datasheet/2/447/LAD52CXXL01_1-3003079.pdf; Working Voltage: 5V; Clamping Voltage: 9.8V

## Sheet Actuators.SchDoc
size 250 x 176 mm; Date: 17.10.2024r.; Author: Bartłomiej Smoter; Revision: v1; SheetNumber: 6; SheetTotal: 6
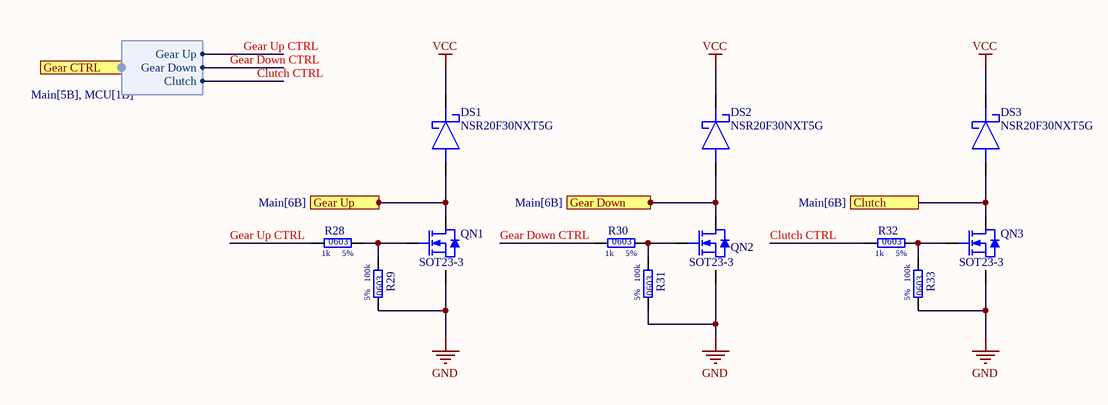
[diagram p5: Actuators.SchDoc]

### Parts
DS1  Man. Part Num.: NSR20F30NXT5G  [0603]  (hidden comment: DS_NSR20F30NXT5G)
DS2  Man. Part Num.: NSR20F30NXT5G  [0603]  (hidden comment: DS_NSR20F30NXT5G)
DS3  Man. Part Num.: NSR20F30NXT5G  [0603]  (hidden comment: DS_NSR20F30NXT5G)
QN1  Case/Package: SOT23-3  [SOT23]  (hidden comment: QN_IRLML6344TRPBF)
QN2  Case/Package: SOT23-3  [SOT23]  (hidden comment: QN_IRLML6344TRPBF)
QN3  Case/Package: SOT23-3  [SOT23]  (hidden comment: QN_IRLML6344TRPBF)
R28  Tolerance: 5%  Resistance: 1k  Case/Package: 0603  [0603_HandSold_Resistor]  (hidden comment: R_1k_0603_5)
R29  Tolerance: 5%  Resistance: 100k  Case/Package: 0603  [0603_HandSold_Resistor]  (hidden comment: R_100k_0603_5)
R30  Tolerance: 5%  Resistance: 1k  Case/Package: 0603  [0603_HandSold_Resistor]  (hidden comment: R_1k_0603_5)
R31  Tolerance: 5%  Resistance: 100k  Case/Package: 0603  [0603_HandSold_Resistor]  (hidden comment: R_100k_0603_5)
R32  Tolerance: 5%  Resistance: 1k  Case/Package: 0603  [0603_HandSold_Resistor]  (hidden comment: R_1k_0603_5)
R33  Tolerance: 5%  Resistance: 100k  Case/Package: 0603  [0603_HandSold_Resistor]  (hidden comment: R_100k_0603_5)

### Ports
Clutch (see Main[6B]), Gear CTRL (harness Gears, see Main[5B], MCU[1B]), Gear Down (see Main[6B]), Gear Up (see Main[6B])

### Harnesses
Gears: Gear Up, Gear Down, Clutch

### Nets
GND: QN1.3(S) QN2.3(S) QN3.3(S) R29.2 R31.2 R33.2
VCC: DS1.1(K) DS2.1(K) DS3.1(K)  [project net 12V_IN]
Clutch: DS3.2(A) QN3.2(D) ; port Clutch
Clutch CTRL: R32.1 ; port Gear CTRL.Clutch
Gear Down: DS2.2(A) QN2.2(D) ; port Gear Down
Gear Down CTRL: R30.1 ; port Gear CTRL.Gear Down
Gear Up: DS1.2(A) QN1.2(D) ; port Gear Up
Gear Up CTRL: R28.1 ; port Gear CTRL.Gear Up
NetQN1_1: QN1.1(G) R28.2 R29.1
NetQN2_1: QN2.1(G) R30.2 R31.1
NetQN3_1: QN3.1(G) R32.2 R33.1

### Notes on the sheet
- Name:
- Author:
- Project:
- Revision:
- Date:

### Library data of the parts
DS1-DS3 = CMP-004-00030-1: Schottky, 480mV 2A 1.75W 0603; Revision Num.: 1; Reverse Voltage: 30V; Max. Forward Voltage: 480mV; Power: 1.75W; Mounting Technology: SMT; Type of Diode: Schottky; Case/Package: 0603; Max. Forward Current: 2A; HelpURL: https://www.mouser.pl/datasheet/2/308/1/NSR20F30_D-2318285.pdf
QN1-QN3 = CMP-002-000010-11: Trans MOSFET N-CH 30V 5A 3-Pin SOT-23 T/R; pin to pad: 2>3 3>2; Vgs / Vbe: 12V; Revision Num.: Revision #1; Rds / Rce: 29m; Power: 1.3W; Man. Part Num.: IRLML6344TRPBF; Id / Ic: 5A; Mounting Technology: SMT; Vds / Vce: 30V; HelpURL: https://www.mouser.pl/datasheet/2/196/Infineon_IRLML6344_DataSheet_v01_01_EN-3166606.pdf; Transistor Type: NMOS
R28 R30 R32 = CMP-009-00001-19: as R1 on sheet PowerSupply; HelpURL: https://eu.mouser.com/datasheet/2/447/YAGEO_PYu_RC_Group_51_RoHS_L_12-3313492.pdf; Mounting Technology: SMT
R29 R31 R33 = CMP-009-00012-11: Revision Num.: 1; Voltage Rating: 50V; Power: 100mW; HelpURL: https://www.tme.eu/Document/fd8030aace7fa4ecbd326eab752e0f92/CQ%20datasheet.pdf; Mounting Technology: SMT

## Nets that join several sheets
5V: Main (J1.4), PowerSupply (5 pins)
12V_IN: Main (J1.7), PowerSupply (F1.1 TVS1.2), Actuators (DS1.1 DS2.1 DS3.1)
A3V3: PowerSupply (C30.1 C31.1 L2.2), MCU (C32.1 C33.1 UP1.9), Analog_Section (C39.1 OPAMP1.8)
AGND: PowerSupply (C30.2 C31.2), MCU (C32.2 C33.2 FB2.2 UP1.8), Analog_Section (10 pins)
GND: Main (J1.1 J1.11), PowerSupply (22 pins), MCU (18 pins), CANTransiver (5 pins), Actuators (6 pins)
VDD: PowerSupply (5 pins), MCU (15 pins), CANTransiver (FB4.1)
Air_Press: Main (J1.12), Analog_Section (R13.1 TVS3.2)
Air_Press_RC_LPF: MCU (UP1.15), Analog_Section (5 pins)
CAN_H: Main (J1.2), CANTransiver (R20.2)
CAN_L: Main (J1.8), CANTransiver (R21.2)
CAN_RX: MCU (UP1.32), CANTransiver (R23.1)
CAN_TX: MCU (UP1.33), CANTransiver (R22.1)
Clutch: Main (J1.10), Actuators (DS3.2 QN3.2)
Clutch CTRL: MCU (UP1.25), Actuators (R32.1)
Gear Cut: Main (J1.5), MCU (UP1.14)
Gear Down: Main (J1.3), Actuators (DS2.2 QN2.2)
Gear Down CTRL: MCU (UP1.29), Actuators (R30.1)
Gear Pos: Main (J1.6), Analog_Section (R7.1 TVS2.2)
Gear POS_SIG: MCU (UP1.12), Analog_Section (5 pins)
Gear Up: Main (J1.9), Actuators (DS1.2 QN1.2)
Gear Up CTRL: MCU (UP1.27), Actuators (R28.1)